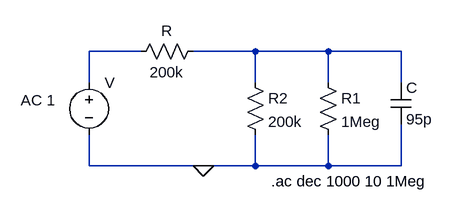
[diagram p0: schematic Exp4Part1a.asc]
Exp4Part1a.asc, the LTspice schematic file:
Version 4
SHEET 1 880 680
WIRE 160 96 80 96
WIRE 336 96 240 96
WIRE 448 96 336 96
WIRE 560 96 448 96
WIRE 80 144 80 96
WIRE 336 144 336 96
WIRE 448 144 448 96
WIRE 560 144 560 96
WIRE 80 272 80 224
WIRE 256 272 80 272
WIRE 336 272 336 224
WIRE 336 272 256 272
WIRE 448 272 448 224
WIRE 448 272 336 272
WIRE 560 272 560 208
WIRE 560 272 448 272
FLAG 256 272 0
SYMBOL res 256 80 R90
WINDOW 0 0 56 VBottom 2
WINDOW 3 32 56 VTop 2
SYMATTR InstName R
SYMATTR Value 200k
SYMBOL res 320 128 R0
SYMATTR InstName R2
SYMATTR Value 200k
SYMBOL voltage 80 128 R0
WINDOW 123 -105 43 Left 2
WINDOW 39 0 0 Left 0
SYMATTR InstName V
SYMATTR Value ""
SYMATTR Value2 AC 1
SYMBOL res 432 128 R0
SYMATTR InstName R1
SYMATTR Value 1Meg
SYMBOL cap 544 144 R0
SYMATTR InstName C
SYMATTR Value 95p
TEXT 360 296 Left 2 !.ac dec 1000 10 1Meg

The netlist it stands for:
* Exp4Part1a.asc
R N002 N001 200k
R2 N002 0 200k
V N001 0 AC 1
R1 N002 0 1Meg
C N002 0 95p
.ac dec 1000 10 1Meg
.backanno
.end